# EAGLE design v1 (EAGLE 7.0.0)
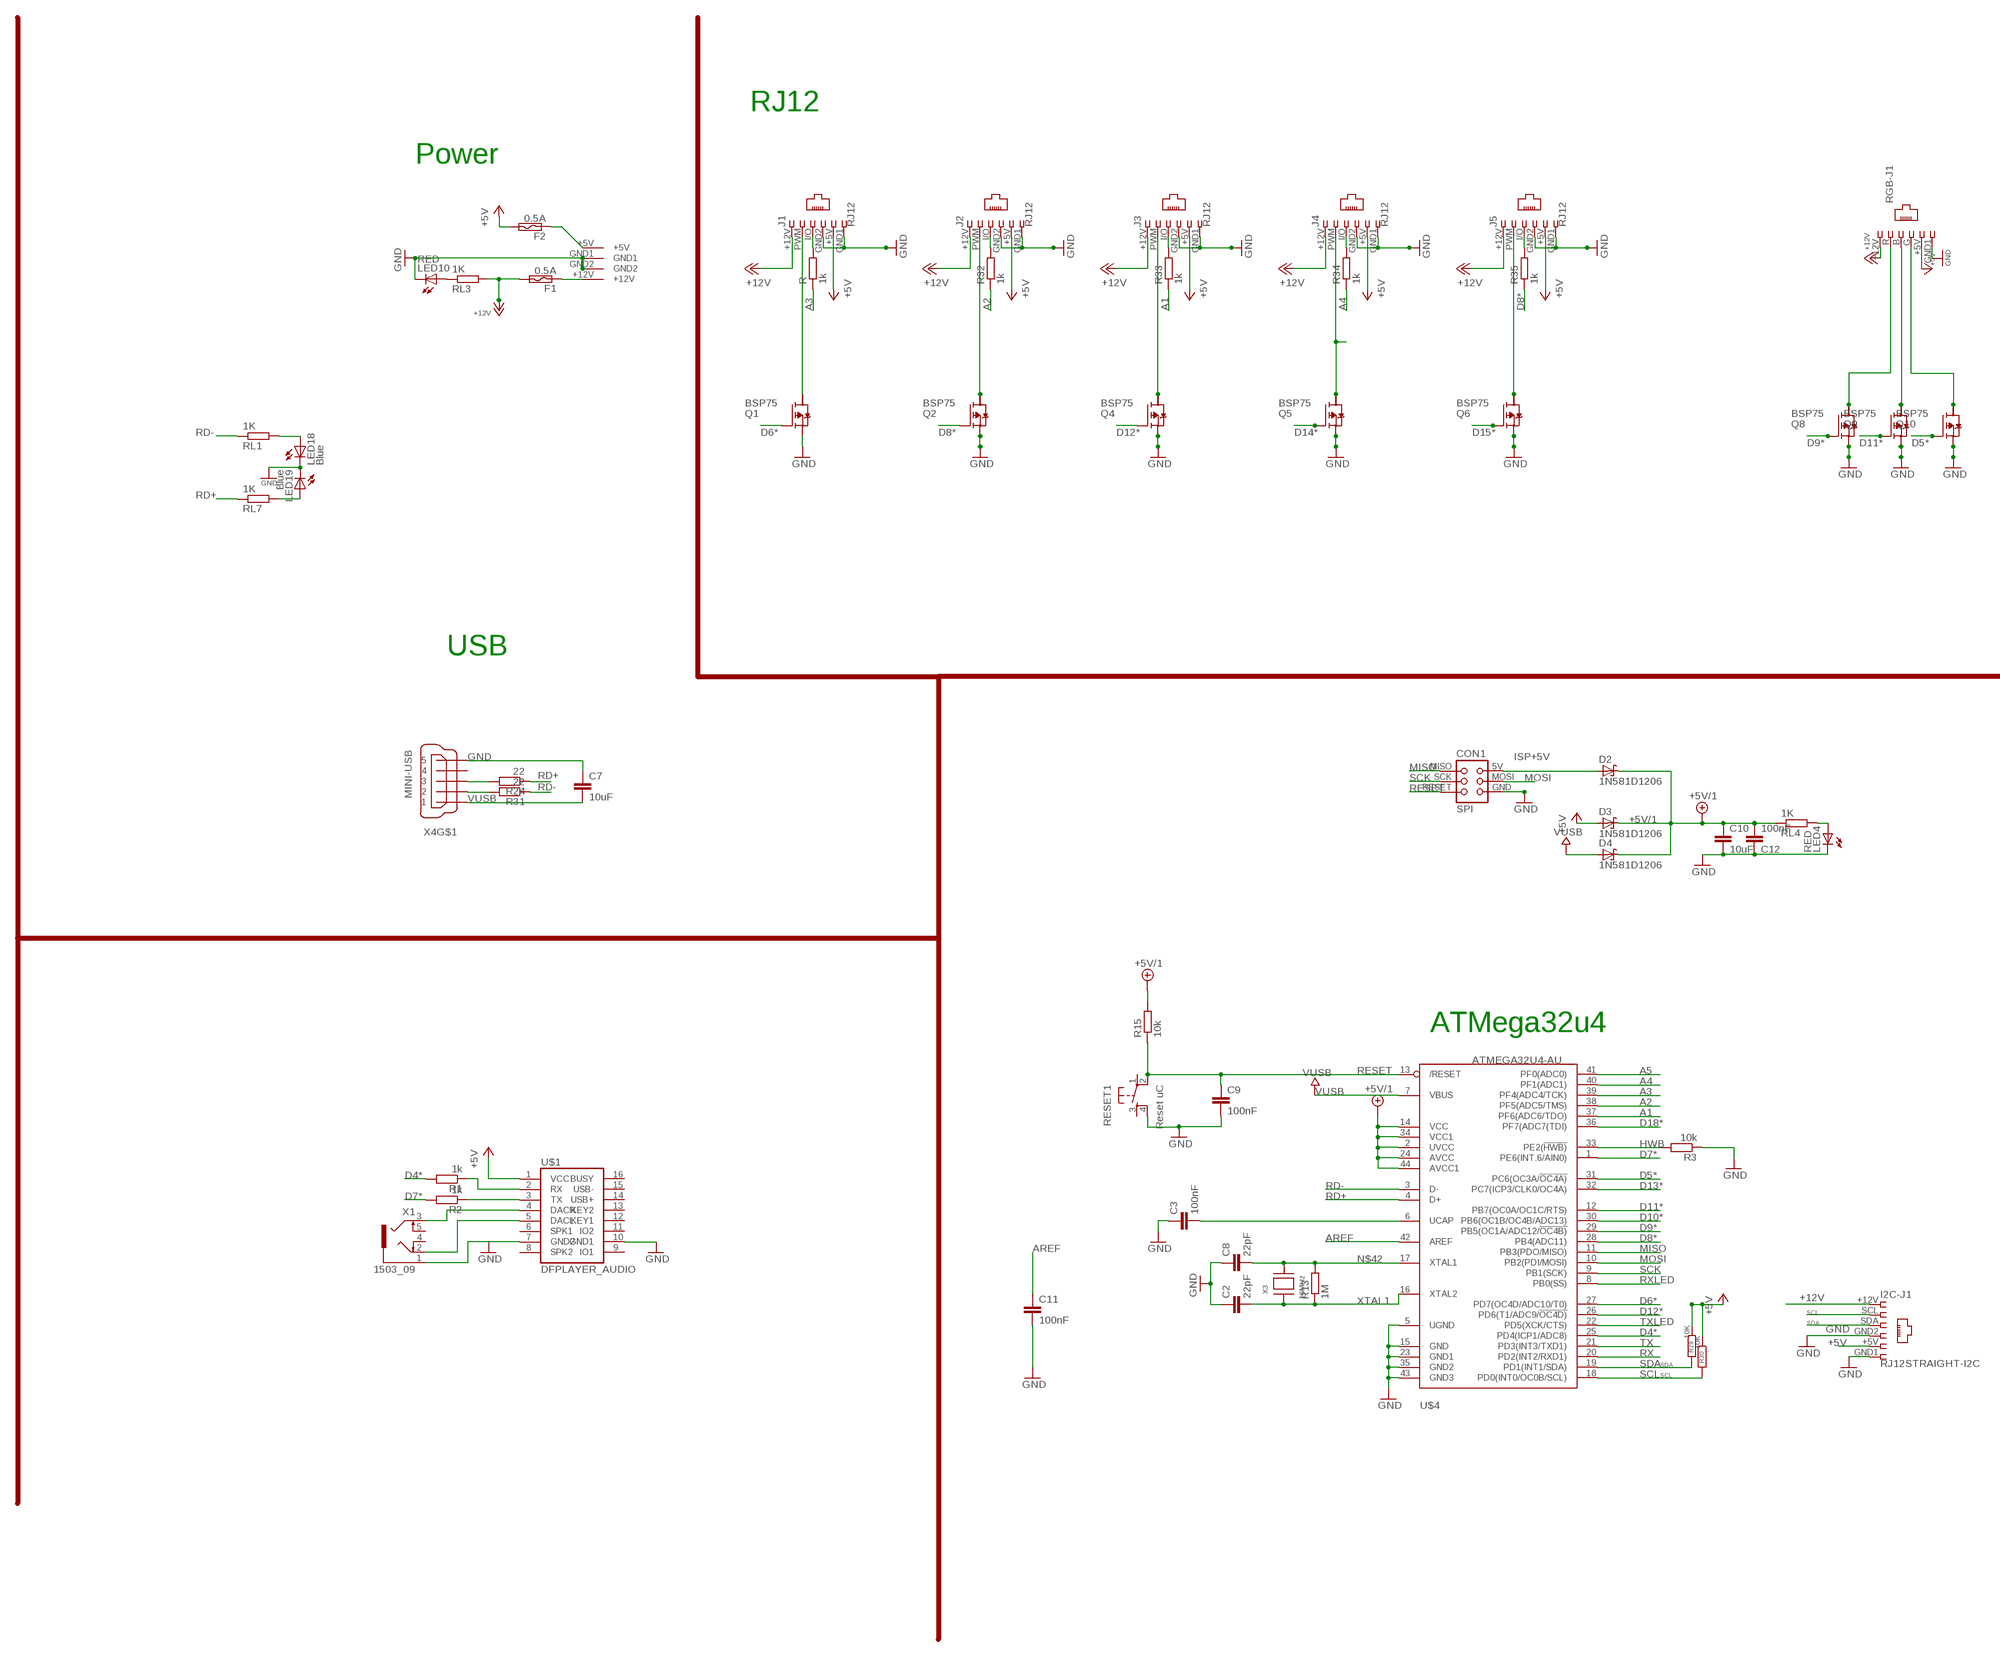
[diagram p0: schematic, sheet 1, part 1 of 2]
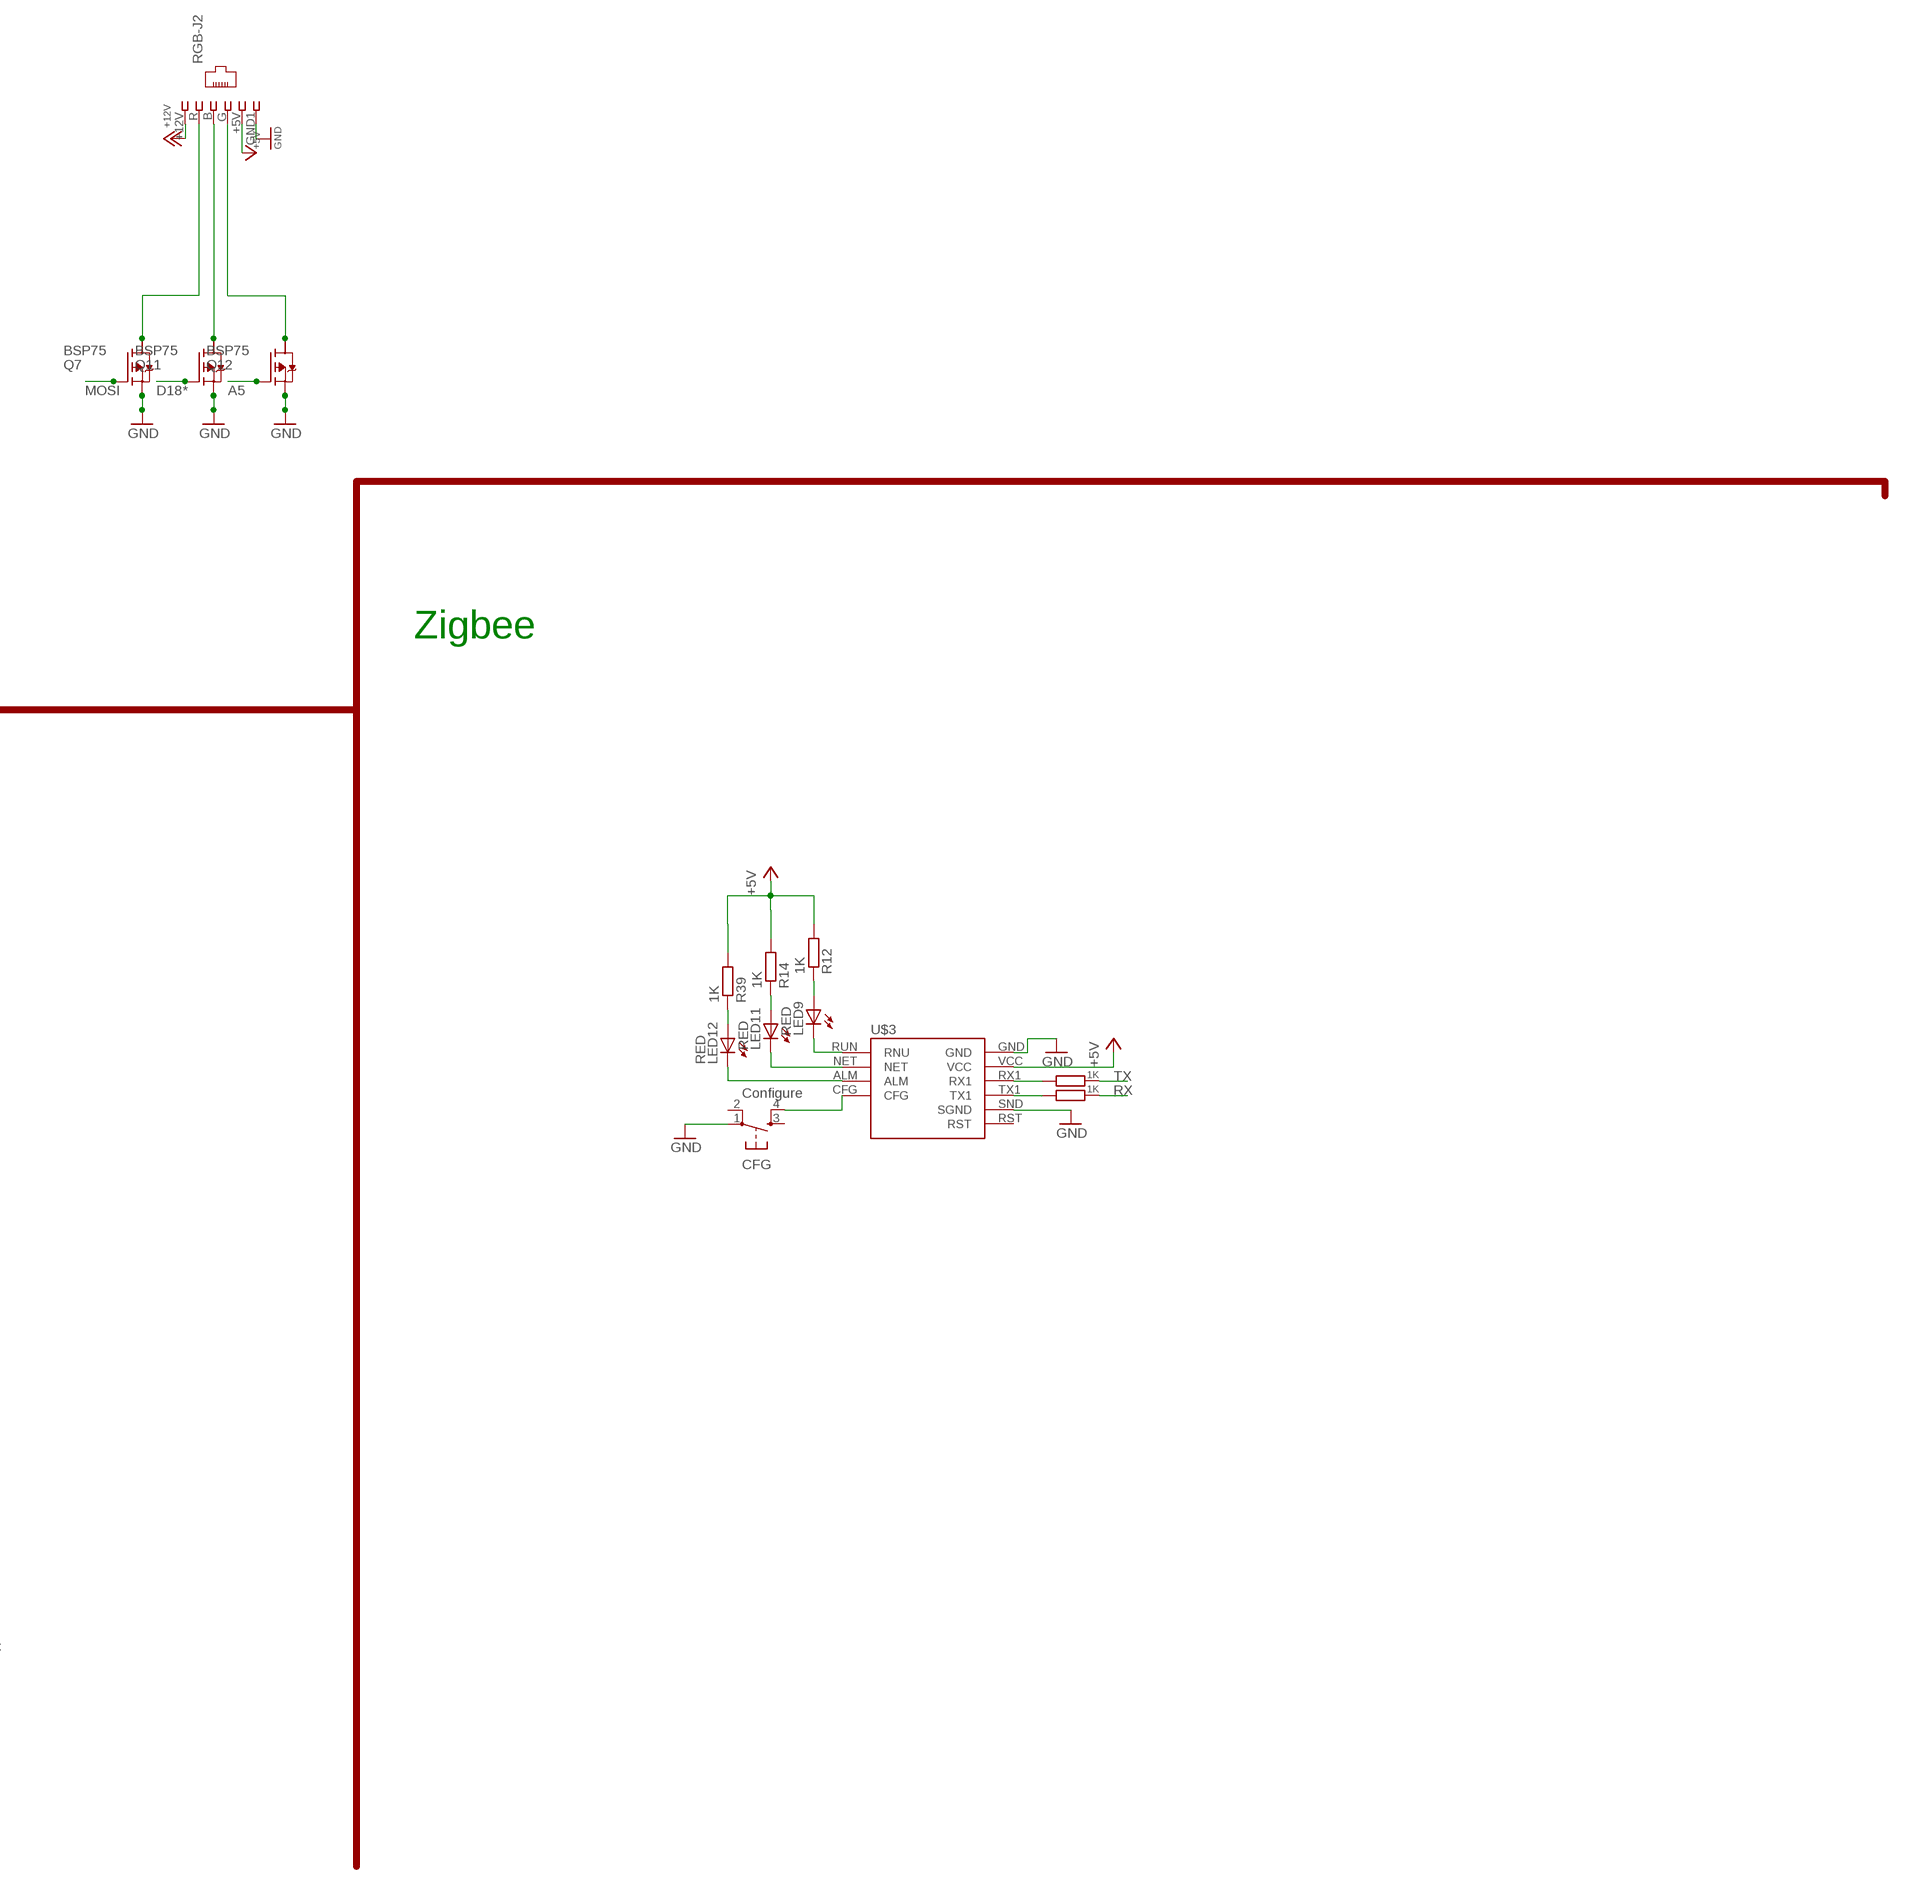
[diagram p1: schematic, sheet 1, part 2 of 2]

## Parts
C2  22pF  C-EUC1206  [C1206]
C3  100nF  C-EUC1206  [C1206]
C7  10uF  C-EUC1206  [C1206]
C8  22pF  C-EUC1206  [C1206]
C9  100nF  C-EUC1206  [C1206]
C10  10uF  C-EUC1206  [C1206]
C11  100nF  C-EUC1206  [C1206]
C12  100nF  C-EUC1206  [C1206]
CFG  Configure  TAC_SWITCHSMD  [TACTILE_SWITCH_SMD]
CON1  SPI  TINYISPT  [TC2030-MCP-NL]
D2  1N581D1206  [LED-1206]
D3  1N581D1206  [LED-1206]
D4  1N581D1206  [LED-1206]
F1  0.5A  POLYSWITCHSMD1812  [C1812]
F2  0.5A  POLYSWITCHSMD1812  [C1812]
I2C-J1  RJ12STRAIGHT-I2C  [RJ12-STRAIGHT-I2C]
J1  RJ12  RJ12STRAIGHT  [RJ12-STRAIGHT]
J2  RJ12  RJ12STRAIGHT  [RJ12-STRAIGHT]
J3  RJ12  RJ12STRAIGHT  [RJ12-STRAIGHT]
J4  RJ12  RJ12STRAIGHT  [RJ12-STRAIGHT]
J5  RJ12  RJ12STRAIGHT  [RJ12-STRAIGHT]
LED4  RED  LEDCHIPLED_1206  [CHIPLED_1206]
LED9  RED  LEDCHIP-LED0805  [CHIP-LED0805]
LED10  RED  LEDCHIPLED_1206  [CHIPLED_1206]
LED11  RED  LEDCHIP-LED0805  [CHIP-LED0805]
LED12  RED  LEDCHIP-LED0805  [CHIP-LED0805]
LED18  Blue  LEDCHIPLED_1206  [CHIPLED_1206]
LED19  Blue  LEDCHIPLED_1206  [CHIPLED_1206]
Q1  BSP75  BSP613P  [PG-SOT-223]
Q2  BSP75  BSP613P  [PG-SOT-223]
Q4  BSP75  BSP613P  [PG-SOT-223]
Q5  BSP75  BSP613P  [PG-SOT-223]
Q6  BSP75  BSP613P  [PG-SOT-223]
Q7  BSP75  BSP613P  [PG-SOT-223]
Q8  BSP75  BSP613P  [PG-SOT-223]
Q9  BSP75  BSP613P  [PG-SOT-223]
Q10  BSP75  BSP613P  [PG-SOT-223]
Q11  BSP75  BSP613P  [PG-SOT-223]
Q12  BSP75  BSP613P  [PG-SOT-223]
R  1k  R-EU_R0805  [R0805]
R1  1k  R-EU_R0805  [R0805]
R2  1k  R-EU_R0805  [R0805]
R3  10k  R-EU_M0805  [M0805]
R8  1K  R-EU_R0805  [R0805]
R11  1K  R-EU_R0805  [R0805]
R12  1K  R-EU_R0805  [R0805]
R13  1M  R-EU_R1206  [R1206]
R14  1K  R-EU_R0805  [R0805]
R15  10k  R-EU_M0805  [M0805]
R24  22  R-EU_M1206  [M1206]
R29  10K  R-EU_M0805  [M0805]
R30  10K  R-EU_M0805  [M0805]
R31  22  R-EU_M1206  [M1206]
R32  1k  R-EU_R0805  [R0805]
R33  1k  R-EU_R0805  [R0805]
R34  1k  R-EU_R0805  [R0805]
R35  1k  R-EU_R0805  [R0805]
R39  1K  R-EU_R0805  [R0805]
RESET1  Reset uC  TAC_SWITCHSMD  [TACTILE_SWITCH_SMD]
RGB-J1  RJ12  RJ12STRAIGHT-RGB  [RJ12-STRAIGHT-RGB]
RGB-J2  RJ12  RJ12STRAIGHT-RGB  [RJ12-STRAIGHT-RGB]
RL1  1K  R-EU_R0805  [R0805]
RL3  1K  R-EU_R0805  [R0805]
RL4  1K  R-EU_R0805  [R0805]
RL7  1K  R-EU_R0805  [R0805]
U$1  DFPLAYER_AUDIO  [DIL16-7]
U$3  SZ05-ZIGBEESMD  [SZ05-ZIGBEE3]
U$4  ATMEGA32U4-AU  [TQFP44]
U$6  KPJX-4S-S  [KPJX-4S-S]
X1  1503_09  [1503_09]
X3  16MHz  XTALNX6035  [NX6035]
X4  MINI-USB  MINI-USB-SCHIELD-32005-201  [32005-201]

## Nets
+5V [power]: D3.A F2.2 I2C-J1.+5V J1.+5V J2.+5V J3.+5V J4.+5V J5.+5V R12.2 R14.2 R29.1 R30.1 R39.2 RGB-J1.+5V RGB-J2.+5V U$1.1(VCC) U$3.VCC
+5V/1 [fine]: C10.1 C12.2 D2.C D3.C D4.C R15.2 RL4.1 U$4.2(UVCC) U$4.14(VCC) U$4.24(AVCC) U$4.34(VCC1) U$4.44(AVCC1)
+12V [power]: F1.2 I2C-J1.+12V J1.+12V J2.+12V J3.+12V J4.+12V J5.+12V RGB-J1.+12V RGB-J2.+12V RL3.2
A1: R33.1 U$4.37(PF6(ADC6/TDO))
A2: R32.1 U$4.38(PF5(ADC5/TMS))
A3: R.1 U$4.39(PF4(ADC4/TCK))
A4: R34.1 U$4.40(PF1(ADC1))
A5: Q12.1(G) U$4.41(PF0(ADC0))
AREF: C11.1 U$4.42(AREF)
D4*: R1.2 U$4.25(PD4(ICP1/ADC8))
D5*: Q10.1(G) U$4.31(PC6(OC3A/!OC4A))
D6*: Q1.1(G) U$4.27(PD7(OC4D/ADC10/T0))
D7*: R2.2 U$4.1(PE6(INT.6/AIN0))
D8*: Q2.1(G) R35.1 U$4.28(PB4(ADC11))
D9*: Q8.1(G) U$4.29(PB5(OC1A/ADC12/!OC4B))
D10*: U$4.30(PB6(OC1B/OC4B/ADC13))
D11*: Q9.1(G) U$4.12(PB7(OC0A/OC1C/RTS))
D12*: Q4.1(G) U$4.26(PD6(T1/ADC9/!OC4D))
D13*: U$4.32(PC7(ICP3/CLK0/OC4A))
D14*: Q5.1(G)
D15*: Q6.1(G)
D18*: Q11.1(G) U$4.36(PF7(ADC7(TDI))
D+USB: R24.2 X4.3
D-USB: R31.2 X4.2
GND [power]: C2.1 C3.1 C7.1 C8.1 C9.2 C10.2 C11.2 C12.1 CFG.1 CON1.GND I2C-J1.GND1 I2C-J1.GND2 J1.GND1 J1.GND2 J2.GND1 J2.GND2 J3.GND1 J3.GND2 J4.GND1 J4.GND2 J5.GND1 J5.GND2 LED4.C LED10.C LED18.C LED19.C Q1.3(S) Q2.3(S) Q4.3(S) Q5.3(S) Q6.3(S) Q7.3(S) Q8.3(S) Q9.3(S) Q10.3(S) Q11.3(S) Q12.3(S) R3.1 RESET1.4 RGB-J1.GND1 RGB-J2.GND1 U$1.7(GND2) U$1.10(GND1) U$3.GND U$3.SND(SGND) U$4.5(UGND) U$4.15(GND) U$4.23(GND1) U$4.35(GND2) U$4.43(GND3) U$6.GND1 U$6.GND2 X1.1 X4.5
GND1 [VIN]: LED9.C U$3.RUN(RNU)
GND2 [VIN]: LED11.C U$3.NET
GND3 [VIN]: LED12.C U$3.ALM
HWB: R3.2 U$4.33(PE2(!HWB))
ISP+5V: CON1.5V(VCC) D2.A
MISO: CON1.MISO U$4.11(PB3(PDO/MISO))
MOSI: CON1.MOSI Q7.1(G) U$4.10(PB2(PDI/MOSI))
N$1: J3.PWM Q4.2(D)
N$2: J2.I/O R32.2
N$3: R1.1 U$1.2(RX)
N$5: J4.PWM Q5.2(D)
N$6 [aref]: Q10.2(D) RGB-J1.G
N$7: J3.I/O R33.2
N$8: LED18.A RL1.2
N$9: U$1.5(DACL) X1.2
N$10 [aref]: Q11.2(D) RGB-J2.B
N$11: R11.2 U$3.RX1
N$12: LED4.A RL4.2
N$13: R2.1 U$1.3(TX)
N$14: LED19.A RL7.2
N$15: U$1.4(DACR) X1.3
N$16: C3.2 U$4.6(UCAP)
N$18: J1.I/O R.2
N$19: J5.PWM Q6.2(D)
N$20 [aref]: Q7.2(D) RGB-J2.R
N$23 [aref]: Q12.2(D) RGB-J2.G
N$24: R8.2 U$3.TX1
N$25: LED9.A R12.1
N$26: LED11.A R14.1
N$27: LED12.A R39.1
N$28: J2.PWM Q2.2(D)
N$29: J4.I/O R34.2
N$32: J5.I/O R35.2
N$34: J1.PWM Q1.2(D)
N$35: CFG.4 U$3.CFG
N$38: F2.1 U$6.+5V
N$39: F1.1 U$6.+12V
N$42: C8.2 R13.2 U$4.17(XTAL1) X3.P$2
N$50 [aref]: Q9.2(D) RGB-J1.B
N$68 [aref]: Q8.2(D) RGB-J1.R
N$75: LED10.A RL3.1
RD+: R24.1 RL7.1 U$4.4(D+)
RD-: R31.1 RL1.1 U$4.3(D-)
RESET: C9.1 CON1.RESET R15.1 RESET1.2 U$4.13(/RESET)
RX: R8.1 U$4.20(PD2(INT2/RXD1))
RXLED: U$4.8(PB0(SS))
SCK: CON1.SCK U$4.9(PB1(SCK))
SCL: I2C-J1.SCL R30.2 U$4.18(PD0(INT0/OC0B/SCL))
SDA: I2C-J1.SDA R29.2 U$4.19(PD1(INT1/SDA))
TX: R11.1 U$4.21(PD3(INT3/TXD1))
TXLED: U$4.22(PD5(XCK/CTS))
VUSB: C7.2 D4.A U$4.7(VBUS) X4.1
XTAL1: C2.2 R13.1 U$4.16(XTAL2) X3.P$1
Unconnected: CFG.2 CFG.3 Q1.4(D) Q2.4(D) Q4.4(D) Q5.4(D) Q6.4(D) Q7.4(D) Q8.4(D) Q9.4(D) Q10.4(D) Q11.4(D) Q12.4(D) RESET1.1 RESET1.3 U$1.6(SPK1) U$1.8(SPK2) U$1.9(IO1) U$1.11(IO2) U$1.12(KEY1) U$1.13(KEY2) U$1.14(USB+) U$1.15(USB-) U$3.RST X1.4 X1.5 X4.4 X4.M1(S:S1) X4.M2(S:S2) X4.M3(S:S3) X4.M4(S:S4)

## Notes on the sheet
- RJ12
- Power
- Zigbee
- USB
- ATMega32u4

## Power pins joined to a net without a drawn wire
BUSY: U$1.16(BUSY)

## Library data of the parts
C2 C3 C7-C12 = rcl:C-EU: CAPACITOR, European symbol
CFG RESET1 = lpatiny:TAC_SWITCH: Momentary Switch Button commonly used for reset or general input. Spark Fun Electronics SKU : COM-00097
CON1 = lpatiny:TINYISP: CONNECTOR
D2-D4 = lpatiny:1N581*: 1.0A SCHOTTKY BARRIER RECTIFIER Source: http://www.diodes.com/datasheets/ds23001.pdf
F1 F2 = lpatiny:POLYSWITCH: PolySwitch (TM) Resettable Device Source: Data sheet <http://www.farnell.com/datasheets/13482.pdf>
I2C-J1 J1-J5 RGB-J1 RGB-J2 = lpatiny:RJ12: CORCOM Modular RJ Jacks No Shield Source: www.tycoelectronics.com .. ENG_DS_1654001_1099_RJ_L_0507.pdf
LED4 LED9-LED12 LED18 LED19 = adafruit:LED: LED OSRAM: - CHIPLED LG R971, LG N971, LY N971, LG Q971, LY Q971, LO R971, LY R971 LH N974, LH R974 LS Q976, LO Q976, LY Q976 LO Q996 - Hyper CHIPLED LW Q18S LB Q993, LB Q99A, LB R99A - SideLED LS A670, LO A670, LY A670, LG A670, LP A670 LB A673, LV A673, LT A673, LW A673 LH A674 LY A675 LS A676, LA A676, LO A676, LY A676, LW A676 LS A679, LY A679, LG A679 - Hyper Micro SIDELED® LS Y876, LA Y876, LO Y876, LY Y876 LT Y87S - SmartLED LW L88C, LW L88S LB L89C, LB L89S, LG L890 LS L89K, LO L89K, LY L89K LS L896, LA L896, LO L896, LY L896 - TOPLED LS T670, LO T670, LY T670, LG T670, LP T670 LSG T670, LSP T670, LSY T670, LOP T670, LYG T670 LG T671, LOG T671, LSG T671 LB T673, LV T673, LT T673, LW T673 LH T674 LS T676, LA T676, LO T676, LY T676, LB T676, LH T676, LSB T676, LW T676 LB T67C, LV T67C, LT T67C, LS T67K, LO T67K, LY T67K, LW E67C LS E67B, LA E67B, LO E67B, LY E67B, LB E67C, LV E67C, LT E67C LW T67C LS T679, LY T679, LG T679 LS T770, LO T770, LY T770, LG T770, LP T770 LB T773, LV T773, LT T773, LW T773 LH T774 LS E675, LA E675, LY E675, LS T675 LS T776, LA T776, LO T776, LY T776, LB T776 LHGB T686 LT T68C, LB T68C - Hyper Mini TOPLED® LB M676 - Mini TOPLED Santana® LG M470 LS M47K, LO M47K, LY M47K Source: http://www.osram.convergy.de/
Q1 Q2 Q4-Q12 = infineon:BSP613P: SIPMOS (R) Small-Signal-Transistor P-Channel (2 Drain) Source: http://www.infineon.com/dgdl/BSP613P_Rev2.4.pdf; OC_FARNELL: unknown; OC_NEWARK: unknown
R R1 R2 R8 R11-R14 R32-R35 R39 RL1 RL3 RL7 = rcl:R-EU_: RESISTOR, European symbol
R3 R15 R24 R29-R31 RL4 = resistor:R-EU_: RESISTOR, European symbol
U$1 = lpatiny:DFPLAYER_AUDIO
U$3 = lpatiny:SZ05-ZIGBEE
U$4 = adafruit:ATMEGA32U4: http://www.ladyada.net/library/eagle
U$6 = lpatiny:KPJX-4S-S
X1 = con-lumberg:1503_09: Jack connectors according to JISC 6560, 3.5 mm Klinkeneinbaukupplung nach JISC 6560, 3,5 mm, 3-polig/ stereo, abgewinkelte Ausführung, mit 2 Öffnern und Lötaugen, für Leiterplatten Rückseitenmontage Source: http://www.lumberg.com/Produkte/PDFs/1503_09.pdf; OC_FARNELL: 1243244; OC_NEWARK: unknown
X3 = lpatiny:XTAL: Low cost SMT crystals, no capacitors included http://www.ladyada.net/library/eagle
X4 = con-cypressindustries:MINI-USB-SCHIELD-: MINI USB-B Conector Source: www.cypressindustries.com; OC_FARNELL: unknown; OC_NEWARK: unknown

## Net classes
0 default: width 0.305 mm
1 power: width 0.457 mm
2 VIN: width 0.457 mm
3 fine: width 0.305 mm
4 aref: width 0.305 mm

## Board
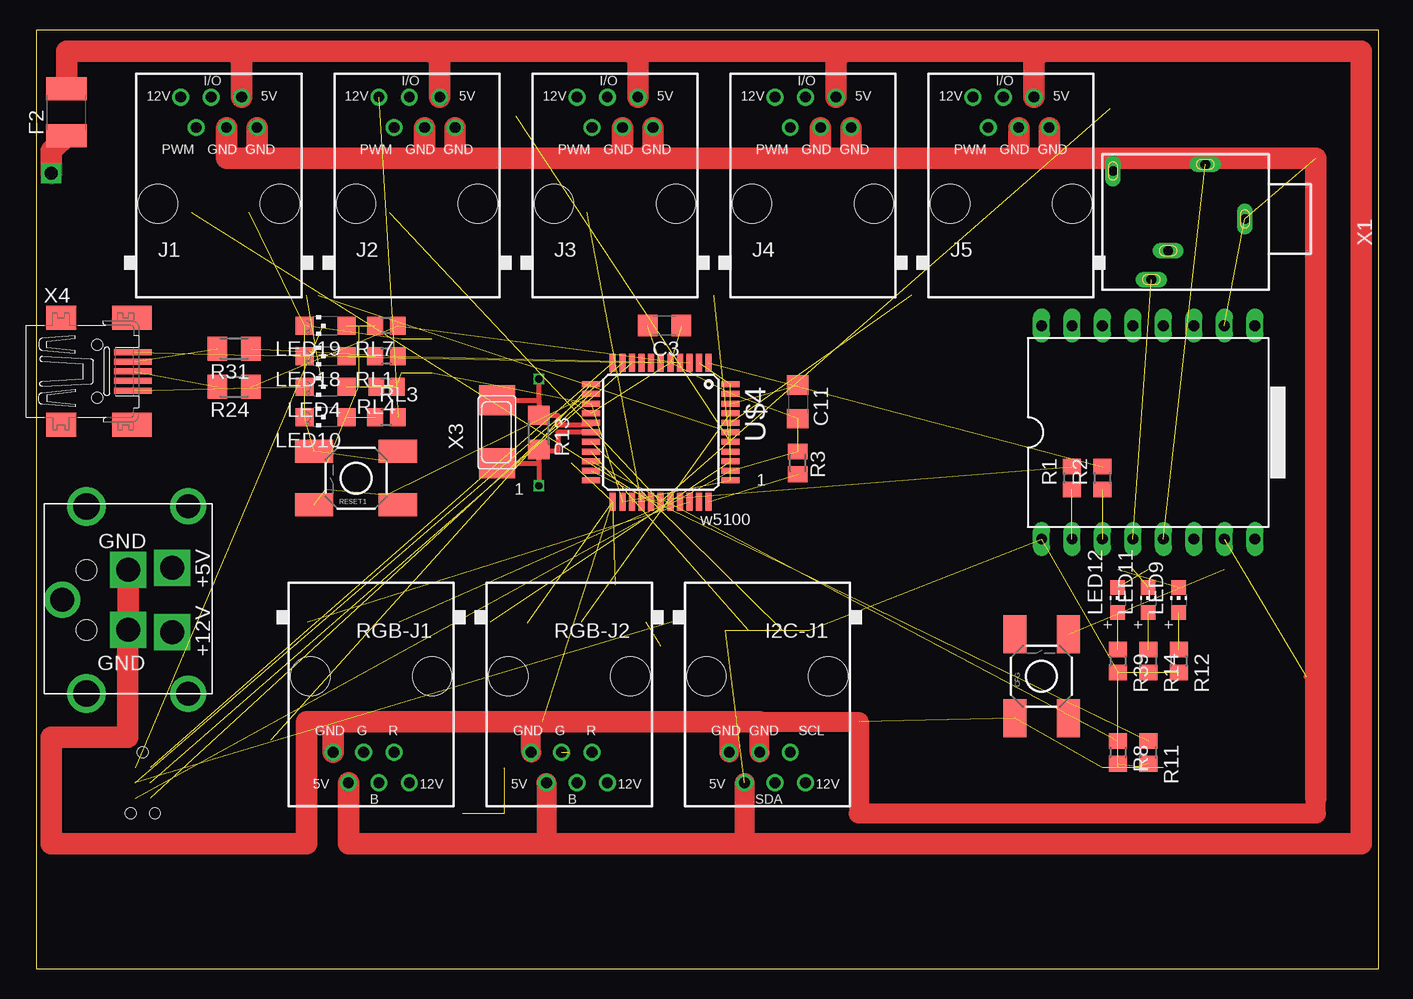
[diagram p2: board, top side]
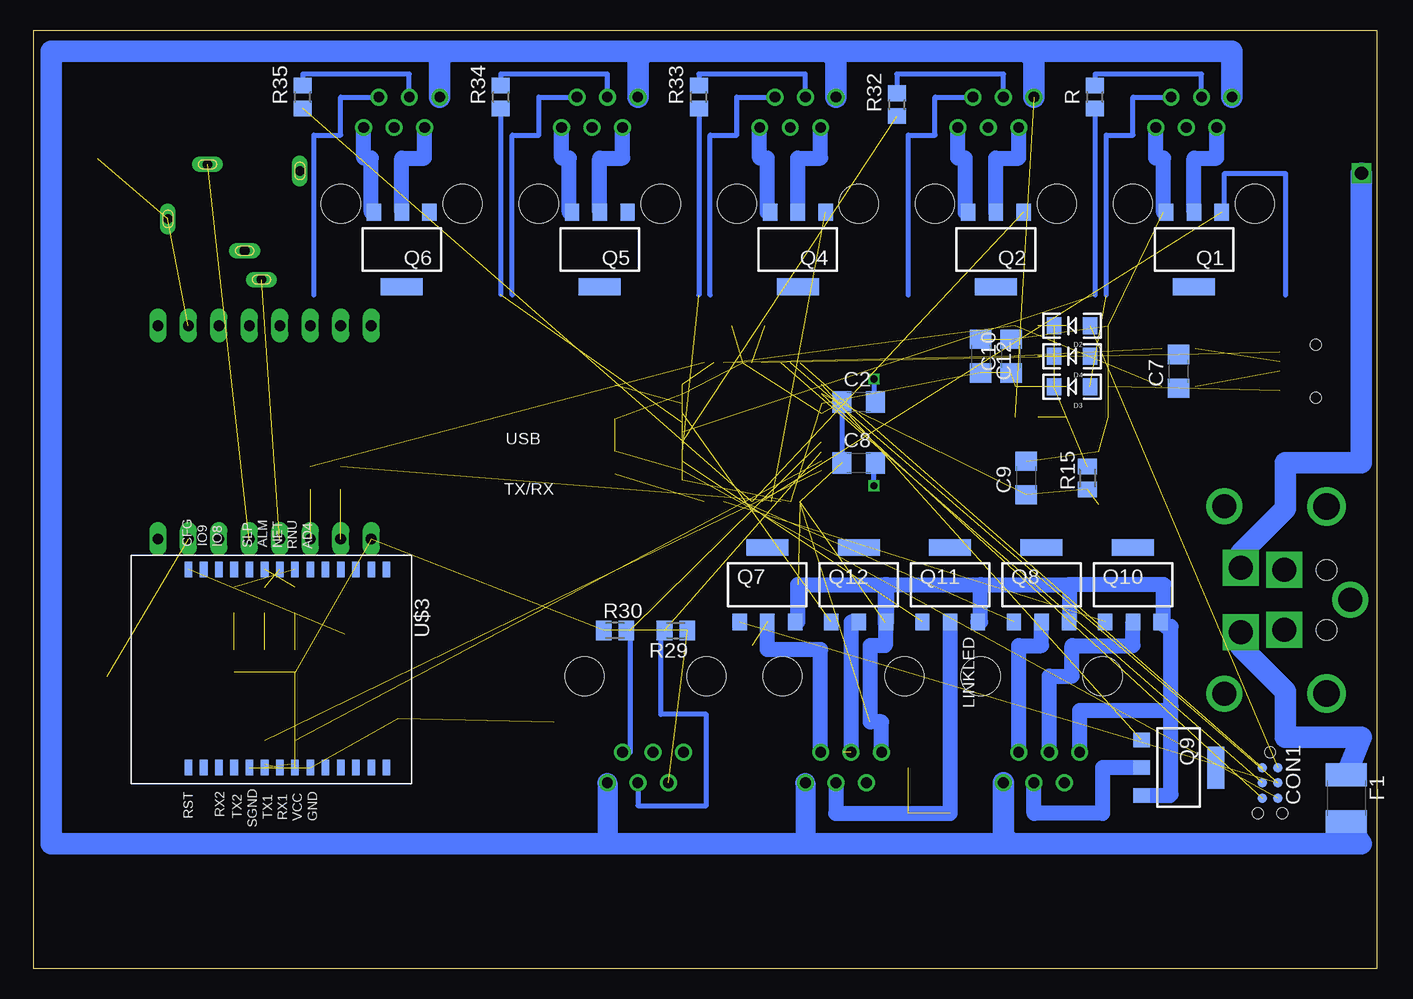
[diagram p3: board, bottom side, seen from below]

Size 111.94 x 78.22 mm. Coordinates in mm from the lower left corner, seen from the top.
Outline: 0,0 111.94,0 111.94,78.22 0,78.22 0,0
Copper layers (1*16): Top 0.035mm / dielectric 1.5mm / Bottom 0.035mm
Design rules "Fusion_eagle_rule_v1.1": minimum track width 6mil, minimum drill 12mil, track to track 6mil, track to pad 6mil, pad to pad 6mil, via to via 6mil, smd to smd 0mil, copper to edge 10mil, drill to drill 10mil, minimum pad ring 10mil, minimum via ring 6mil, stop-mask expansion 2mil, vias tented up to drill 100mil, thermal gap 10mil
bKeepout: area -1.3,51.1 to 114.3,79; area -7.6,48.5 to 108,76.5
tRestrict: area -6.3,56.1 to 116.8,82.8; area 133.3,51.1 to 228.6,72.6
bRestrict: area 133.3,28.2 to 228.6,49.8
vRestrict: area 47,28.2 to 62.2,32; area 47,29.5 to 50.8,43.4; area 58.4,30.7 to 62.2,43.4; area 47,39.6 to 62.2,43.4; area 47,19.3 to 62.2,23.1

### Footprints (pad centres in the part's own frame; a part is rotated, then mirrored left to right if it is on the bottom)
C1206 = smd 1.6 x 1.8: 1 -1.4,0; 2 1.4,0
TACTILE_SWITCH_SMD = smd 3.175 x 1.905: 1 -3.493,2.223; 2 3.493,2.223; 3 -3.493,-2.223; 4 3.493,-2.223
TC2030-MCP-NL = smd 0.787 x 0.787: 5V 1.27,0.635; GND 3.81,0.635; MISO 1.27,-0.635; MOSI 2.54,0.635; RESET 3.81,-0.635; SCK 2.54,-0.635 | hole 0.889: 0,0; 5.08,-1.016; 5.08,1.016
LED-1206 = smd 1.2 x 1.4: A -1.5,0; C 1.5,0
C1812 = smd 1.9 x 3.4: 1 -1.95,0; 2 1.95,0
RJ12-STRAIGHT-I2C = drill 0.9 pad 1.4: +5V 1.905,8.89; +12V -3.175,8.89; GND1 3.175,6.35; GND2 0.635,6.35; SCL -1.905,6.35; SDA -0.635,8.89 | hole 3.251: -5.08,0; 5.08,0
RJ12-STRAIGHT = drill 0.9 pad 1.4: +5V 1.905,8.89; +12V -3.175,8.89; GND1 3.175,6.35; GND2 0.635,6.35; I/O -0.635,8.89; PWM -1.905,6.35 | hole 3.251: -5.08,0; 5.08,0
CHIPLED_1206 = smd 1.5 x 1.5: A 0,-1.75; C 0,1.75
CHIP-LED0805 = smd 1.2 x 1.2: A 0,-1.05; C 0,1.05
PG-SOT-223 = smd 1.2 x 1.4: 1 -2.311,-3.099; 2 0,-3.099; 3 2.311,-3.099 | smd 3.5 x 1.4: 4 0,3.099
R0805 = smd 1.3 x 1.5: 1 -0.95,0; 2 0.95,0
M0805 = smd 1.3 x 1.6: 1 -0.95,0; 2 0.95,0
R1206 = smd 1.6 x 1.803: 1 -1.422,0; 2 1.422,0
M1206 = smd 1.6 x 2: 1 -1.4,0; 2 1.4,0
RJ12-STRAIGHT-RGB = drill 0.9 pad 1.4: +5V 1.905,8.89; +12V -3.175,8.89; B -0.635,8.89; G 0.635,6.35; GND1 3.175,6.35; R -1.905,6.35 | hole 3.251: -5.08,0; 5.08,0
R0805' = smd 1.3 x 1.5: 1 -0.85,0; 2 0.85,0
DIL16-7 = drill 0.9 long: 1 -8.89,-8.89; 2 -6.35,-8.89; 3 -3.81,-8.89; 4 -1.27,-8.89; 5 1.27,-8.89; 6 3.81,-8.89; 7 6.35,-8.89; 8 8.89,-8.89; 9 8.89,8.89; 10 6.35,8.89; 11 3.81,8.89; 12 1.27,8.89; 13 -1.27,8.89; 14 -3.81,8.89; 15 -6.35,8.89; 16 -8.89,8.89
SZ05-ZIGBEE3 = smd 1.27 x 0.635: AD1 -7.62,6.35; AD2 -7.62,5.08; AD3 -7.62,3.81; AD4 -7.62,2.54; ALM -7.62,-1.27; C485 -7.62,-3.81; CFG -7.62,-7.62; GND 8.89,2.54; IO1 -7.62,8.89; IO2 -7.62,7.62; IO3 8.89,8.89; IO4 8.89,7.62; IO5 8.89,6.35; IO6 8.89,5.08; IO7 8.89,3.81; IO8 -7.62,-5.08; IO9 -7.62,-6.35; MS 8.89,-6.35; NET -7.62,0; RST 8.89,-7.62; RUN -7.62,1.27; RX1 8.89,0; RX2 8.89,-5.08; SLD -7.62,-2.54; SND 8.89,-2.54; TX1 8.89,-1.27; TX2 8.89,-3.81; VCC 8.89,1.27
TQFP44 = smd 1.5 x 0.5: 1 -5.8,4; 2 -5.8,3.2; 3 -5.8,2.4; 4 -5.8,1.6; 5 -5.8,0.8; 6 -5.8,0; 7 -5.8,-0.8; 8 -5.8,-1.6; 9 -5.8,-2.4; 10 -5.8,-3.2; 11 -5.8,-4; 23 5.8,-4; 24 5.8,-3.2; 25 5.8,-2.4; 26 5.8,-1.6; 27 5.8,-0.8; 28 5.8,0; 29 5.8,0.8; 30 5.8,1.6; 31 5.8,2.4; 32 5.8,3.2; 33 5.8,4 | smd 0.5 x 1.5: 12 -4,-5.8; 13 -3.2,-5.8; 14 -2.4,-5.8; 15 -1.6,-5.8; 16 -0.8,-5.8; 17 0,-5.8; 18 0.8,-5.8; 19 1.6,-5.8; 20 2.4,-5.8; 21 3.2,-5.8; 22 4,-5.8; 34 4,5.8; 35 3.2,5.8; 36 2.4,5.8; 37 1.6,5.8; 38 0.8,5.8; 39 0,5.8; 40 -0.8,5.8; 41 -1.6,5.8; 42 -2.4,5.8; 43 -3.2,5.8; 44 -4,5.8
KPJX-4S-S = drill 2 square: +5V 2.7,1.35; +12V -2.7,1.35; GND1 -2.5,5; GND2 2.5,5 | drill 2: P$1 -7.8,0; P$2 7.8,0; P$11 0,10.5 | drill 2.2: P$3 -7.8,8.5; P$4 7.8,8.5 | hole 1.7: -2.5,8.5; 2.5,8.5
1503_09 = drill 0.8 pad 1.2 long: 1 0,-2.1; 2 -4.55,-5.4; 3 5.05,-9.9; 4 -4,-13.1; 5 2.65,-8.5
NX6035 = smd 2.5 x 3: P$1 2.665,0; P$2 -2.565,0
32005-201 = smd 3.1 x 0.5: 1 3,1.6; 2 3,0.8; 3 3,0; 4 3,-0.8; 5 3,-1.6 | smd 2.5 x 2: M1 -3,-4.45; M2 -3,4.45 | smd 3.3 x 2: M3 2.9,4.45; M4 2.9,-4.45 | hole 0.9: 0,2.2; 0,-2.2

### Placement (x,y rotation side)
C2  43.18,47.24 0 bottom
C3  52.39,53.59 180 top
C7  16.51,49.78 90 bottom
C8  43.18,42.16 0 bottom
C9  29.21,40.89 90 bottom
C10  30.48,51.05 90 bottom
C11  63.5,47.24 270 top
C12  33.02,51.05 270 bottom
CFG  83.82,24.38 90 top
CON1  8.89,18.03 270 bottom
D2  25.4,53.59 180 bottom
D3  25.4,48.51 180 bottom
D4  25.4,51.05 180 bottom
F1  2.54,14.22 270 bottom
F2  2.54,71.37 90 top
I2C-J1  60.96,24.38 180 top
J1  15.24,63.75 0 top
J2  31.75,63.75 0 top
J3  48.26,63.75 0 top
J4  64.77,63.75 0 top
J5  81.28,63.75 0 top
LED4  24.13,48.51 90 top
LED9  95.25,30.73 0 top
LED10  24.13,45.97 90 top
LED11  92.71,30.73 0 top
LED12  90.17,30.73 0 top
LED18  24.13,51.05 90 top
LED19  24.13,53.59 90 top
Q1  15.24,59.94 180 bottom
Q2  31.75,59.94 180 bottom
Q4  48.26,59.94 180 bottom
Q5  64.77,59.94 180 bottom
Q6  81.28,59.94 180 bottom
Q7  50.8,32 0 bottom
Q8  27.94,32 0 bottom
Q9  16.51,16.76 270 bottom
Q10  20.32,32 0 bottom
Q11  35.56,32 0 bottom
Q12  43.18,32 0 bottom
R  23.5,72.64 90 bottom
R1  86.36,40.89 90 top
R2  88.9,40.89 90 top
R3  63.5,42.16 270 top
R8  90.17,18.03 270 top
R11  92.71,18.03 270 top
R12  95.25,25.65 270 top
R13  41.91,44.7 270 top
R14  92.71,25.65 270 top
R15  24.13,40.89 90 bottom
R24  16.51,48.51 180 top
R29  58.42,28.19 180 bottom
R30  63.5,28.19 0 bottom
R31  16.51,51.69 180 top
R32  40.01,72.01 90 bottom
R33  56.52,72.64 90 bottom
R34  73.03,72.64 90 bottom
R35  89.53,72.64 90 bottom
R39  90.17,25.65 270 top
RESET1  26.67,40.89 180 top
RGB-J1  27.94,24.38 180 top
RGB-J2  44.45,24.38 180 top
RL1  29.21,51.05 180 top
RL3  29.21,45.97 0 top
RL4  1K  [R0805']  29.21,48.51 180 top
RL7  29.21,53.59 180 top
U$1  92.71,44.7 0 top
U$3  91.44,25.65 270 bottom
U$4  52.07,44.7 270 top
U$6  12.7,30.73 90 top
X1  102.87,62.48 270 top
X3  38.42,44.7 90 top
X4  5.08,49.78 0 top

### Tracks (layer width: path | path; a pad name or v marks a point on that pad's centre or on a via)
+5V  (8 unrouted)
  Top 1.676: I2C-J1.+5V 59.05,10.41 | RGB-J2.+5V 42.55,10.41
  Top 1.778: F2.2 2.54,76.45 16.51,76.45 | 16.51,76.45 33.02,76.45 | 33.02,76.45 49.53,76.45 | 49.53,76.45 67.31,76.45 | 67.31,76.45 83.82,76.45 | 83.82,76.45 110.49,76.45 110.49,10.41 59.05,10.41 42.55,10.41 26.04,10.41 RGB-J1.+5V | J1.+5V 17.14,75.82 16.51,76.45 | J2.+5V 33.66,75.82 33.02,76.45 | J3.+5V 50.16,75.82 49.53,76.45 | J4.+5V 66.67,75.82 67.31,76.45 | J5.+5V 83.19,75.82 83.82,76.45
  Bottom 0.406: 22.54,56.13 22.54,69.47 20.32,69.47 20.32,72.64 J1.+5V | 39.05,56.13 39.05,69.47 36.83,69.47 36.83,72.64 J2.+5V | 55.56,56.13 55.56,69.47 53.34,69.47 53.34,72.64 J3.+5V | 72.07,56.13 72.07,69.47 69.85,69.47 69.85,72.64 J4.+5V | 88.58,56.13 88.58,69.47 86.36,69.47 86.36,72.64 J5.+5V
+5V/1  (11 unrouted)
+12V  (1 unrouted)
  Bottom 1.676: I2C-J1.+12V 64.14,10.41 | RGB-J2.+12V 47.62,10.41
  Bottom 1.778: F1.2 1.27,10.41 30.48,10.41 | 30.48,10.41 47.62,10.41 64.14,10.41 110.49,10.41 110.49,76.45 77.47,76.45 | 77.47,76.45 60.96,76.45 | 60.96,76.45 45.72,76.45 | 45.72,76.45 29.21,76.45 | 29.21,76.45 12.06,76.45 J1.+12V | J3.+12V 45.09,75.82 45.72,76.45 | J4.+12V 61.59,75.82 60.96,76.45 | J5.+12V 78.11,75.82 77.47,76.45 | J2.+12V 28.57,75.82 29.21,76.45 | RGB-J1.+12V 31.11,11.05 30.48,10.41
A1  (1 unrouted)
  Bottom 0.406: R33.1 56.52,56.13
A2  (1 unrouted)
A3  (1 unrouted)
  Bottom 0.406: R.1 23.5,56.13
A4  (1 unrouted)
  Bottom 0.406: R34.1 73.03,56.19
A5  (1 unrouted)
AREF  (1 unrouted)
D4*  (1 unrouted)
D5*  (1 unrouted)
D6*  (1 unrouted)
  Bottom 0.406: Q1.1 12.7,63.04 12.7,66.29 7.62,66.29 7.62,56.13
D7*  (1 unrouted)
D8*  (2 unrouted)
D9*  (1 unrouted)
D11*  (1 unrouted)
D12*  (1 unrouted)
D18*  (1 unrouted)
D+USB  (1 unrouted)
D-USB  (1 unrouted)
GND  (28 unrouted)
  Top 0.457: 7.92,34.09 U$6.GND2 | 105.87,24.33 106.68,24.33
  Top 1.676: I2C-J1.GND1 57.78,20.57 | I2C-J1.GND2 60.33,20.57 68.58,20.57 68.58,12.95 106.68,12.95 106.68,14.22 | RGB-J2.GND1 41.27,20.57
  Top 1.778: 24.13,20.57 22.54,20.57 22.54,10.41 1.27,10.41 1.27,19.3 7.62,19.3 7.62,28.15 U$6.GND1 U$6.GND2 | 24.13,20.57 41.27,20.57 57.78,20.57 60.33,20.57 | 106.68,14.22 106.68,24.33 106.68,67.56 85.09,67.56 | 85.09,67.56 81.28,67.56 | 81.28,67.56 68.58,67.56 | 68.58,67.56 64.77,67.56 | 64.77,67.56 50.8,67.56 | 50.8,67.56 48.26,67.56 | 48.26,67.56 35.56,67.56 | 35.56,67.56 31.75,67.56 | 31.75,67.56 17.78,67.56 | 17.78,67.56 15.88,67.56 J1.GND2 | J1.GND1 18.41,68.2 17.78,67.56 | J2.GND2 32.38,68.2 31.75,67.56 | J2.GND1 34.92,68.2 35.56,67.56 | J3.GND2 48.9,68.2 48.26,67.56 | J3.GND1 51.44,68.2 50.8,67.56 | J4.GND2 65.41,68.2 64.77,67.56 | J4.GND1 67.94,68.2 68.58,67.56 | J5.GND2 81.92,68.2 81.28,67.56 | J5.GND1 84.45,68.2 85.09,67.56 | RGB-J1.GND1 24.77,19.94 24.13,20.57
  Bottom 0.406: C2.1 C8.1
  Bottom 0.457: 17.37,32.21 17.78,32
  Bottom 1.27: Q2.3 34.29,63.04 34.29,67.56 34.92,67.56 J2.GND1 | Q4.3 50.8,63.04 50.8,67.56 51.44,67.56 J3.GND1 | Q5.3 67.31,63.04 67.31,67.56 67.94,67.56 J4.GND1 | Q6.3 83.82,63.04 83.82,67.56 84.45,67.56 J5.GND1 | Q1.3 17.78,63.04 17.78,67.56 18.41,67.56 J1.GND1 | 25.63,32 17.78,32 17.78,28.9 Q10.3 17.62,28.51 17.14,28.51 17.14,21.84 | 25.63,32 Q8.3 | Q9.3 17.23,14.45 17.14,14.54 17.14,21.84 | RGB-J1.GND1 24.77,21.53 17.46,21.53 17.14,21.84 | Q7.3 48.26,28.9 48.26,32 40.96,32 | 40.96,32 40.87,32 | 40.87,32 Q12.3 40.96,28.9 40.96,32 | Q11.3 33.02,28.9 33.02,32 | 33.02,32 25.63,32 | 40.87,32 33.02,32 | RGB-J2.GND1 41.27,20.57 42.23,20.57 42.23,26.92 40.96,26.92 40.96,28.83
GND1  (1 unrouted)
GND2  (1 unrouted)
GND3  (1 unrouted)
HWB  (1 unrouted)
ISP+5V  (1 unrouted)
MISO  (1 unrouted)
MOSI  (2 unrouted)
N$1
  Bottom 1.27: Q4.2 48.26,67.56 46.35,67.56 J3.PWM
N$2
  Bottom 0.406: J2.I/O 31.11,74.55 40.01,74.55 R32.2
N$3  (1 unrouted)
N$5
  Bottom 1.27: Q5.2 64.77,67.56 62.87,67.56 J4.PWM
N$6
  Bottom 1.27: Q10.2 20.32,26.92 25.4,26.92 25.4,24.38 27.3,24.38 RGB-J1.G
N$7
  Bottom 0.406: J3.I/O 47.62,74.55 56.52,74.55 R33.2
N$8  (1 unrouted)
N$9  (1 unrouted)
N$10  (2 unrouted)
  Bottom 1.27: RGB-J2.B 45.09,12.95 35.56,12.95 Q11.2
N$11  (1 unrouted)
N$12  (1 unrouted)
N$13  (1 unrouted)
N$14  (1 unrouted)
N$15  (1 unrouted)
N$16  (1 unrouted)
N$18
  Bottom 0.406: J1.I/O 14.61,74.55 23.5,74.55 R.2
N$19
  Bottom 1.27: Q6.2 81.28,67.56 79.38,67.56 J5.PWM
N$20  (1 unrouted)
  Bottom 1.27: RGB-J2.R 46.35,26.61 50.8,26.61 Q7.2
N$23  (1 unrouted)
  Bottom 1.27: Q12.2 43.81,28.9 RGB-J2.G
N$24  (1 unrouted)
N$25  (1 unrouted)
N$26  (1 unrouted)
N$27  (1 unrouted)
N$28
  Bottom 1.27: Q2.2 31.75,67.56 29.84,67.56 J2.PWM
N$29
  Bottom 0.406: J4.I/O 64.14,74.55 73.03,74.55 R34.2
N$32
  Bottom 0.406: J5.I/O 80.64,74.55 89.53,74.55 R35.2
N$34
  Bottom 1.27: Q1.2 15.24,67.56 13.34,67.56 J1.PWM
N$35  (1 unrouted)
N$38  (via drill 1.1)
  Top 1.778: v1.27,66.29 1.27,68.15 F2.1
  Bottom 1.778: U$6.+5V 11.35,34.62 7.62,38.35 7.62,42.16 1.27,42.16 v1.27,66.29
N$39
  Bottom 1.778: U$6.+12V 11.35,26.84 7.62,23.11 7.62,19.3 1.27,19.3 F1.1
N$42  (via drill 0.6)
  Top 0.406: U$4.17 43.5,44.7 43.5,43.12 41.91,43.12 R13.2 41.91,42.14 | X3.P$2 41.91,42.14 | 41.91,42.14 v41.91,40.26
  Bottom 0.406: v41.91,40.26 41.91,42.03 C8.2
N$50
  Bottom 1.27: Q9.2 22.86,16.76 22.86,12.95 28.57,12.95 RGB-J1.B
N$68
  Bottom 1.27: RGB-J1.R 29.84,26.92 27.94,26.92 Q8.2
N$75  (1 unrouted)
RD+  (2 unrouted)
RD-  (2 unrouted)
RESET  (4 unrouted)
RX  (1 unrouted)
SCK  (1 unrouted)
SCL  (1 unrouted)
  Bottom 0.406: I2C-J1.SCL 62.23,18.03 62.23,28.19 R30.2
SDA  (1 unrouted)
  Bottom 0.406: I2C-J1.SDA 61.59,13.59 55.88,13.59 55.88,21.21 59.69,21.21 59.69,28.19 R29.2
TX  (1 unrouted)
VUSB  (3 unrouted)
XTAL1  (via drill 0.6)
  Top 0.406: U$4.16 46.27,45.34 43.5,45.34 43.5,46.13 R13.1 41.91,47.37 | X3.P$1 41.91,47.37 | 41.91,47.37 v41.91,49.15
  Bottom 0.406: v41.91,49.15 41.91,47.37 C2.2

### Text on the board
tNames: Halloween 2014 | 1 | 1 | w5100
bNames: USB | TX/RX | LINKLED
203bmp: C:/Users/G/Pictures/logo_epfl.bmp